# EAGLE design inversor (EAGLE 8.6.3)
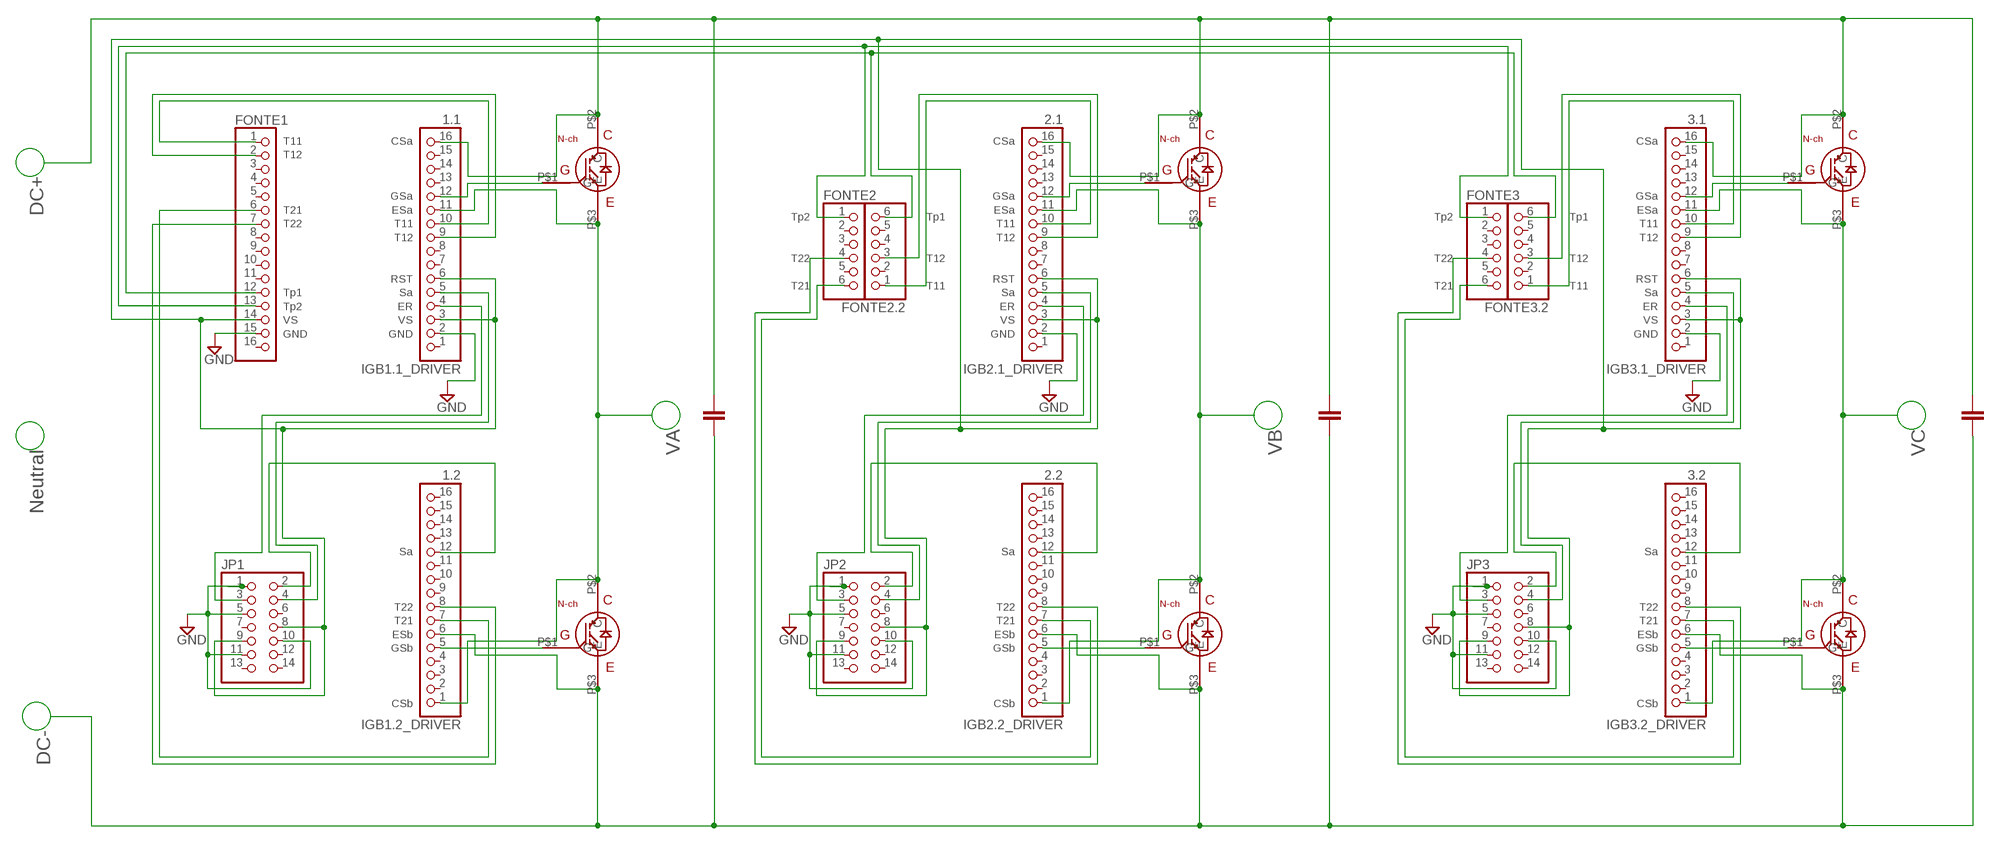
[diagram p0: schematic, sheet 1]

## Parts
FONTE1  PINHD-1X16  [1X16]
FONTE2  PINHD-1X6  [1X06]
FONTE2.2  PINHD-1X6  [1X06]
FONTE3  PINHD-1X6  [1X06]
FONTE3.2  PINHD-1X6  [1X06]
IGB1.1_DRIVER  1.1  PINHD-1X16  [1X16]
IGB1.2_DRIVER  1.2  PINHD-1X16  [1X16]
IGB2.1_DRIVER  2.1  PINHD-1X16  [1X16]
IGB2.2_DRIVER  2.2  PINHD-1X16  [1X16]
IGB3.1_DRIVER  3.1  PINHD-1X16  [1X16]
IGB3.2_DRIVER  3.2  PINHD-1X16  [1X16]
JP1  PINHD-2X7  [2X07]
JP2  PINHD-2X7  [2X07]
JP3  PINHD-2X7  [2X07]
U$1  TO-247A  [TO-247]
U$2  TO-247A  [TO-247]
U$3  TO-247A  [TO-247]
U$4  TO-247A  [TO-247]
U$5  TO-247A  [TO-247]
U$6  TO-247A  [TO-247]

## Nets
DC+: IGB1.1_DRIVER.16 IGB2.1_DRIVER.16 IGB3.1_DRIVER.16 U$1.P$2(C) U$3.P$2(C) U$5.P$2(C)
DC-: IGB1.2_DRIVER.6 IGB2.2_DRIVER.6 IGB3.2_DRIVER.6 U$2.P$3(E) U$4.P$3(E) U$6.P$3(E)
GND: FONTE1.15 IGB1.1_DRIVER.2 IGB2.1_DRIVER.2 IGB3.1_DRIVER.2 JP1.1 JP1.5 JP1.10 JP1.11 JP2.1 JP2.5 JP2.10 JP2.11 JP3.1 JP3.5 JP3.10 JP3.11
N$1: IGB1.1_DRIVER.5 JP1.4
N$3: IGB1.2_DRIVER.12 JP1.2
N$4: IGB1.1_DRIVER.4 JP1.3
N$5: FONTE1.1 IGB1.1_DRIVER.10
N$6: FONTE1.2 IGB1.1_DRIVER.9
N$7: FONTE1.7 IGB1.2_DRIVER.8
N$8: FONTE1.6 IGB1.2_DRIVER.7
N$9: IGB3.1_DRIVER.4 JP3.3
N$13: IGB1.2_DRIVER.5 U$2.P$1(G)
N$15: IGB2.1_DRIVER.5 JP2.4
N$16: IGB2.2_DRIVER.12 JP2.2
N$17: IGB2.1_DRIVER.4 JP2.3
N$18: FONTE2.2.1 IGB2.1_DRIVER.10
N$19: FONTE2.2.3 IGB2.1_DRIVER.9
N$20: FONTE2.4 IGB2.2_DRIVER.8
N$21: FONTE2.6 IGB2.2_DRIVER.7
N$23: IGB2.1_DRIVER.12 U$3.P$1(G)
N$25: IGB2.2_DRIVER.5 U$4.P$1(G)
N$29: IGB3.1_DRIVER.5 JP3.4
N$30: IGB3.2_DRIVER.12 JP3.2
N$32: FONTE3.2.1 IGB3.1_DRIVER.10
N$33: FONTE3.2.3 IGB3.1_DRIVER.9
N$34: FONTE3.4 IGB3.2_DRIVER.8
N$35: FONTE3.6 IGB3.2_DRIVER.7
N$36: IGB3.1_DRIVER.12 U$5.P$1(G)
N$38: IGB3.2_DRIVER.5 U$6.P$1(G)
TP1: FONTE1.12 FONTE2.2.6 FONTE3.2.6
TP2: FONTE1.13 FONTE2.1 FONTE3.1
VA: IGB1.1_DRIVER.11 IGB1.2_DRIVER.1 U$1.P$3(E) U$2.P$2(C)
VB: IGB2.1_DRIVER.11 IGB2.2_DRIVER.1 U$3.P$3(E) U$4.P$2(C)
VC: IGB3.1_DRIVER.11 IGB3.2_DRIVER.1 U$5.P$3(E) U$6.P$2(C)
VS: FONTE1.14 IGB1.1_DRIVER.3 IGB1.1_DRIVER.6 IGB2.1_DRIVER.3 IGB2.1_DRIVER.6 IGB3.1_DRIVER.3 IGB3.1_DRIVER.6 JP1.8 JP1.9 JP2.8 JP2.9 JP3.8 JP3.9
VS1: IGB1.1_DRIVER.12 U$1.P$1(G)
Unconnected: FONTE1.3 FONTE1.4 FONTE1.5 FONTE1.8 FONTE1.9 FONTE1.10 FONTE1.11 FONTE1.16 FONTE2.2 FONTE2.2.2 FONTE2.2.4 FONTE2.2.5 FONTE2.3 FONTE2.5 FONTE3.2 FONTE3.2.2 FONTE3.2.4 FONTE3.2.5 FONTE3.3 FONTE3.5 IGB1.1_DRIVER.1 IGB1.1_DRIVER.7 IGB1.1_DRIVER.8 IGB1.1_DRIVER.13 IGB1.1_DRIVER.14 IGB1.1_DRIVER.15 IGB1.2_DRIVER.2 IGB1.2_DRIVER.3 IGB1.2_DRIVER.4 IGB1.2_DRIVER.9 IGB1.2_DRIVER.10 IGB1.2_DRIVER.11 IGB1.2_DRIVER.13 IGB1.2_DRIVER.14 IGB1.2_DRIVER.15 IGB1.2_DRIVER.16 IGB2.1_DRIVER.1 IGB2.1_DRIVER.7 IGB2.1_DRIVER.8 IGB2.1_DRIVER.13 IGB2.1_DRIVER.14 IGB2.1_DRIVER.15 IGB2.2_DRIVER.2 IGB2.2_DRIVER.3 IGB2.2_DRIVER.4 IGB2.2_DRIVER.9 IGB2.2_DRIVER.10 IGB2.2_DRIVER.11 IGB2.2_DRIVER.13 IGB2.2_DRIVER.14 IGB2.2_DRIVER.15 IGB2.2_DRIVER.16 IGB3.1_DRIVER.1 IGB3.1_DRIVER.7 IGB3.1_DRIVER.8 IGB3.1_DRIVER.13 IGB3.1_DRIVER.14 IGB3.1_DRIVER.15 IGB3.2_DRIVER.2 IGB3.2_DRIVER.3 IGB3.2_DRIVER.4 IGB3.2_DRIVER.9 IGB3.2_DRIVER.10 IGB3.2_DRIVER.11 IGB3.2_DRIVER.13 IGB3.2_DRIVER.14 IGB3.2_DRIVER.15 IGB3.2_DRIVER.16 JP1.6 JP1.7 JP1.12 JP1.13 JP1.14 JP2.6 JP2.7 JP2.12 JP2.13 JP2.14 JP3.6 JP3.7 JP3.12 JP3.13 JP3.14

## Notes on the sheet
- DC+
- T11
  T12
  
  
  
  T21
  T22
  
  
  
  
  Tp1
  Tp2
  VS
  GND
- CSa
  
  
  
  GSa
  ESa
  T11
  T12
  
  
  RST
  Sa
  ER
  VS
  GND
- CSa
  
  
  
  GSa
  ESa
  T11
  T12
  
  
  RST
  Sa
  ER
  VS
  GND
- CSa
  
  
  
  GSa
  ESa
  T11
  T12
  
  
  RST
  Sa
  ER
  VS
  GND
- Tp2
  
  
  T22
  
  T21
- Tp1
  
  
  T12
  
  T11
- Tp2
  
  
  T22
  
  T21
- Tp1
  
  
  T12
  
  T11
- VA | VB | VC
- Neutral
- Sa
  
  
  
  T22
  T21
  ESb
  GSb
  
  
  
  CSb
- Sa
  
  
  
  T22
  T21
  ESb
  GSb
  
  
  
  CSb
- Sa
  
  
  
  T22
  T21
  ESb
  GSb
  
  
  
  CSb
- DC-

## Library data of the parts
FONTE1 IGB1.1_DRIVER IGB1.2_DRIVER IGB2.1_DRIVER IGB2.2_DRIVER IGB3.1_DRIVER IGB3.2_DRIVER = pinhead:PINHD-1X16: PIN HEADER
FONTE2 FONTE2.2 FONTE3 FONTE3.2 = pinhead:PINHD-1X6: PIN HEADER
JP1-JP3 = pinhead:PINHD-2X7: PIN HEADER
U$1-U$6 = to-247_n-channel_igbt:TO-247

## Board
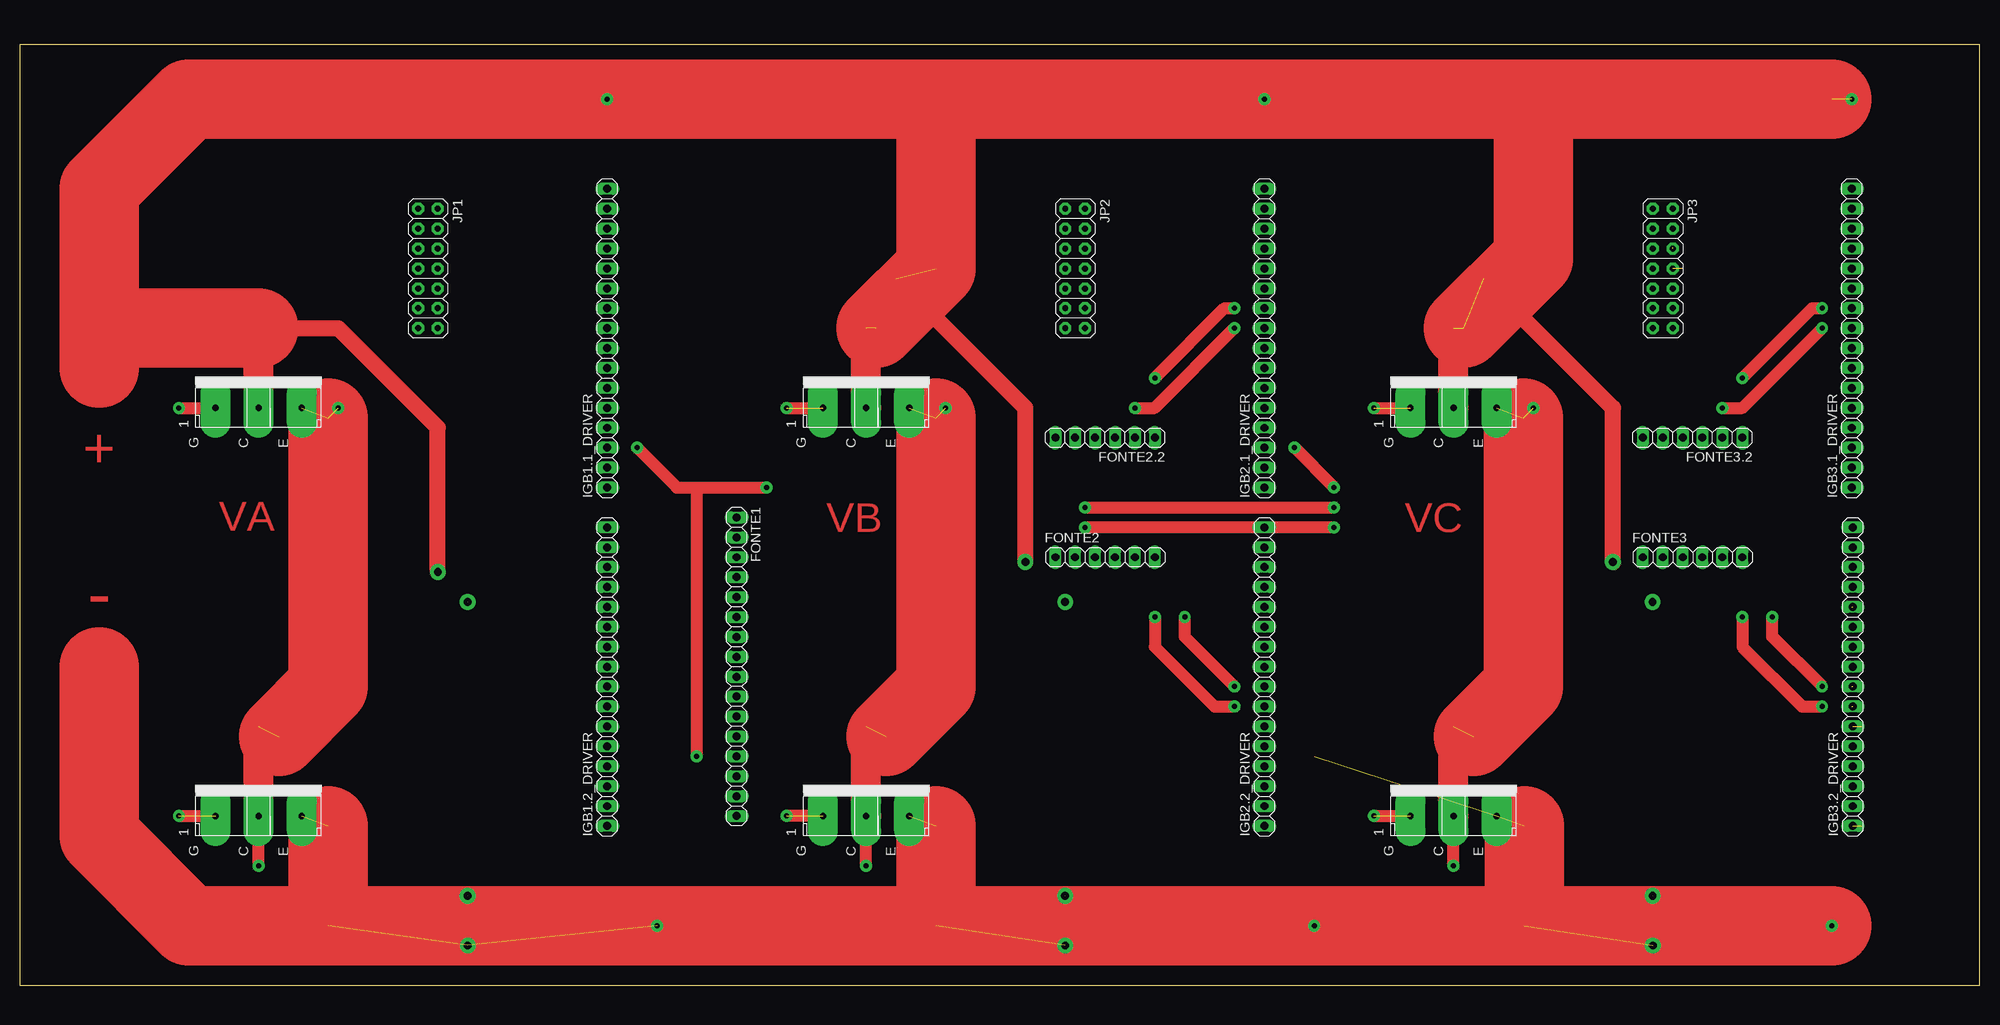
[diagram p1: board, top side]
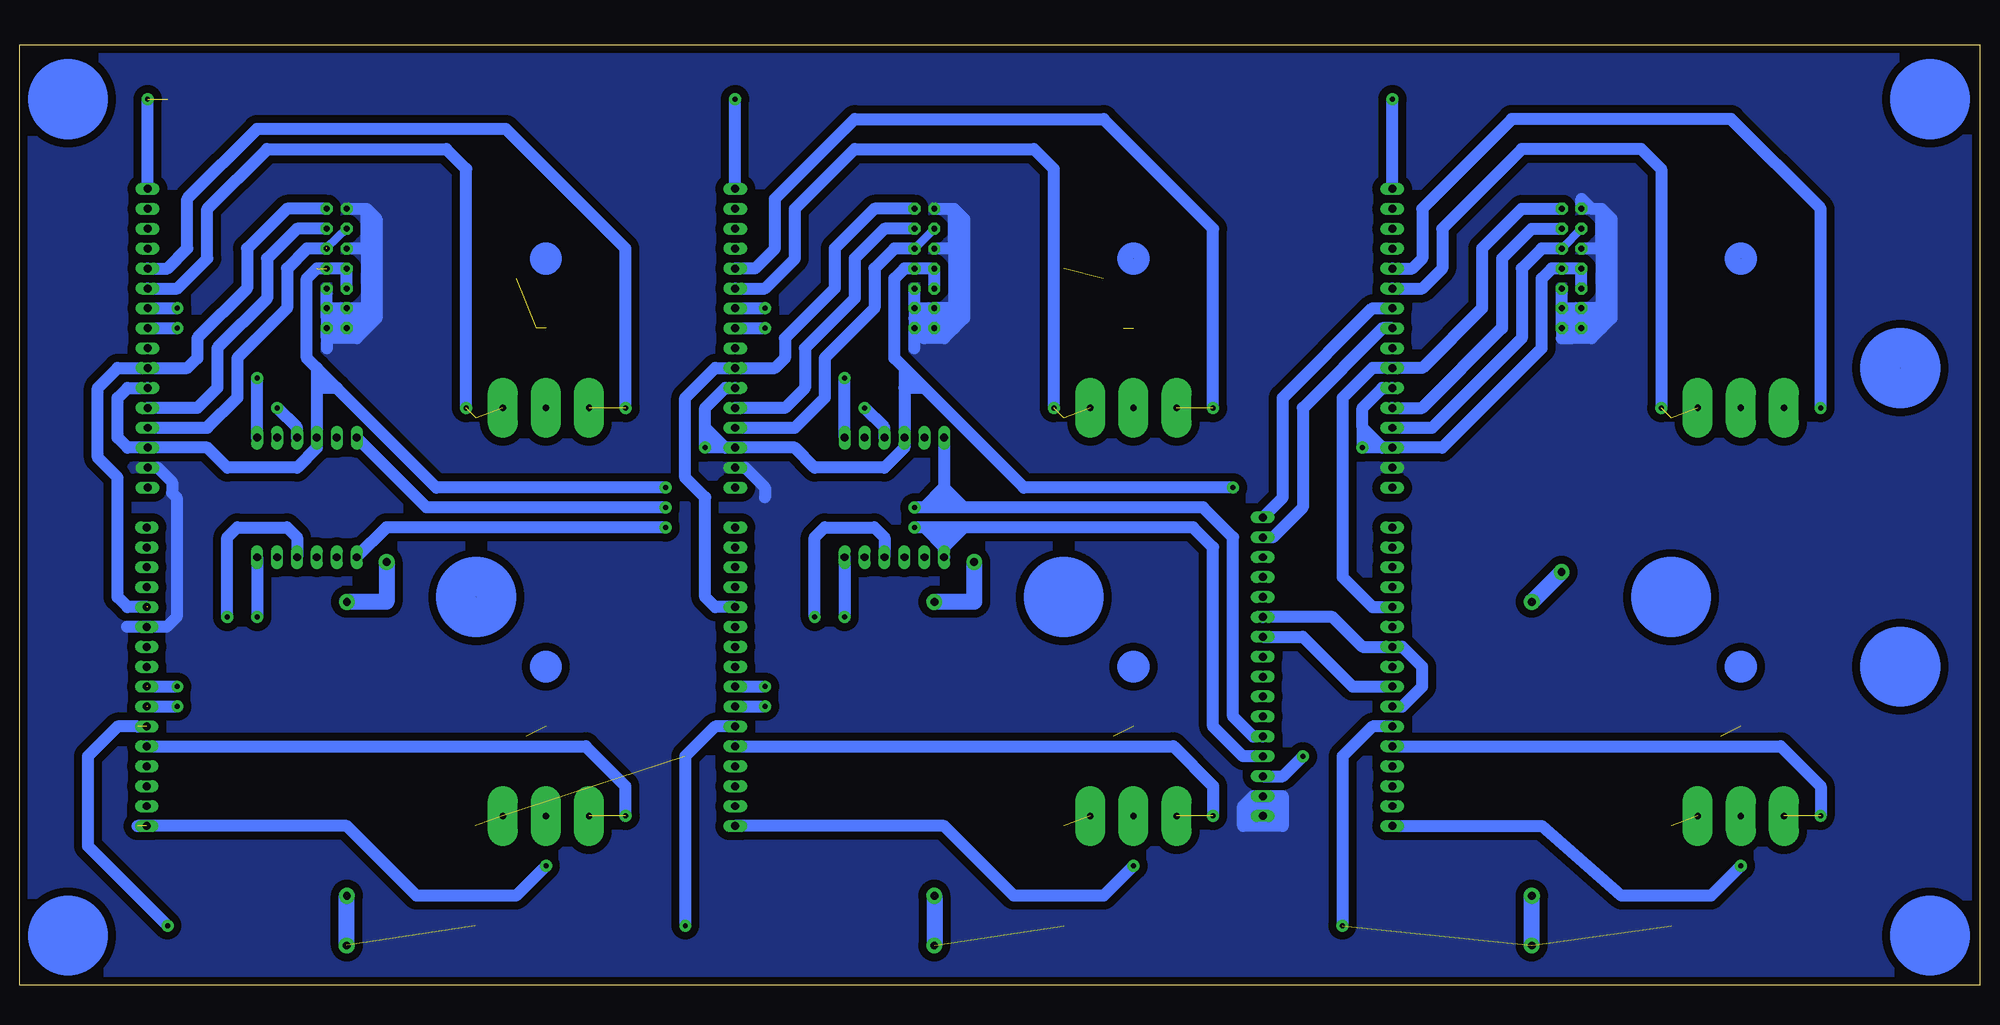
[diagram p2: board, bottom side, seen from below]

Size 250 x 120 mm. Coordinates in mm from the lower left corner, seen from the top.
Outline: 0,0 250,0 250,120 0,120 0,0
Copper layers (1*16): Top 0.035mm / dielectric 1.5mm / Bottom 0.035mm
Design rules "default": minimum track width 6mil, minimum drill 0.35mm, track to track 6mil, track to pad 6mil, pad to pad 6mil, via to via 6mil, smd to smd 6mil, copper to edge 40mil, drill to drill 6mil, minimum pad ring 10mil, minimum via ring 8mil, stop-mask expansion 4mil, vias tented up to drill 0mil, thermal gap 10mil

### Footprints (pad centres in the part's own frame; a part is rotated, then mirrored left to right if it is on the bottom)
1X16 = drill 1.016 long: 1 -19.05,0; 2 -16.51,0; 3 -13.97,0; 4 -11.43,0; 5 -8.89,0; 6 -6.35,0; 7 -3.81,0; 8 -1.27,0; 9 1.27,0; 10 3.81,0; 11 6.35,0; 12 8.89,0; 13 11.43,0; 14 13.97,0; 15 16.51,0; 16 19.05,0
1X06 = drill 1.016 long: 1 -6.35,0; 2 -3.81,0; 3 -1.27,0; 4 1.27,0; 5 3.81,0; 6 6.35,0
2X07 = drill 0.762 pad 1.524 octagon: 1 -7.62,-1.27; 2 -7.62,1.27; 3 -5.08,-1.27; 4 -5.08,1.27; 5 -2.54,-1.27; 6 -2.54,1.27; 7 0,-1.27; 8 0,1.27; 9 2.54,-1.27; 10 2.54,1.27; 11 5.08,-1.27; 12 5.08,1.27; 13 7.62,-1.27; 14 7.62,1.27
TO-247 = drill 0.8 pad 3.81 long: P$1 0,5.5; P$2 0,0; P$3 0,-5.5

### Placement (x,y rotation side)
FONTE1  91.44,40.64 270 top
FONTE2  138.43,54.61 0 top
FONTE2.2  138.43,69.85 180 top
FONTE3  213.36,54.61 0 top
FONTE3.2  213.36,69.85 180 top
IGB1.1_DRIVER  74.93,82.55 90 top
IGB1.2_DRIVER  74.93,39.37 90 top
IGB2.1_DRIVER  158.75,82.55 90 top
IGB2.2_DRIVER  158.75,39.37 90 top
IGB3.1_DRIVER  233.68,82.55 90 top
IGB3.2_DRIVER  233.79,39.37 90 top
JP1  52.07,91.44 270 top
JP2  134.62,91.44 270 top
JP3  209.55,91.44 270 top
U$1  30.48,73.66 90 top
U$2  30.48,21.59 90 top
U$3  107.95,73.66 90 top
U$4  107.95,21.59 90 top
U$5  182.88,73.66 90 top
U$6  182.88,21.59 90 top

### Tracks (layer width: path | path; a pad name or v marks a point on that pad's centre or on a via)
DC+  (via drill 0.6 pad 1.52, 1 pad 2)  (6 unrouted)
  Top 10.16: 193.04,113.03 v158.75,113.03 116.84,113.03 | 116.84,113.03 v74.93,113.03 21.59,113.03 10.16,101.6 10.16,83.82 | 10.16,83.82 10.16,78.74 | 193.04,113.03 231.14,113.03 | 30.48,83.82 10.16,83.82 | 109.22,83.82 116.84,91.44 116.84,113.03 | 184.15,83.82 193.04,92.71 193.04,113.03
  Top 2.032: v53.34,52.72 53.34,71.12 40.64,83.82 30.48,83.82 | v128.27,53.99 128.27,73.66 111.76,90.17 | v203.2,53.99 203.2,73.66 186.69,90.17
  Top 3.81: U$1.P$2 30.48,83.82 | U$3.P$2 107.95,83.82 | U$5.P$2 182.88,83.82
  Bottom 1.524: IGB3.1_DRIVER.16 v233.68,113.03 | IGB2.1_DRIVER.16 v158.75,113.03 | IGB1.1_DRIVER.16 v74.93,113.03
  Bottom 2.032: v57.15,48.91 v53.34,52.72 | v128.27,53.99 128.27,48.91 v133.34,48.91 | v203.2,53.99 203.2,48.91 v208.26,48.91
DC-  (via drill 0.64 pad 1.52, 1 pad 2)  (12 unrouted)
  Top 10.16: 10.16,40.64 10.16,19.05 21.59,7.62 39.37,7.62 | 39.37,7.62 116.84,7.62 | 116.84,7.62 191.88,7.62 | 191.88,20.32 191.88,7.62 | 116.84,20.32 116.84,7.62 | 39.37,7.62 39.37,20.32 | 191.88,7.62 v231.14,7.62
  Bottom 1.524: IGB1.2_DRIVER.6 77.47,33.02 81.28,29.21 v81.28,7.62 | IGB2.2_DRIVER.6 161.29,33.02 165.1,29.21 v165.1,7.62 | 234.95,33.02 237.49,33.02 241.3,29.21 241.3,17.78 v231.14,7.62
  Bottom 2.032: v57.15,5.08 57.15,11.43 | 133.35,11.43 v133.35,5.08 | v208.28,5.08 208.28,11.43
  other vias: 133.34,11.41 57.14,11.41 208.27,11.41
GND
  Bottom 1.524: 236.33,45.72 231.25,45.72 229.98,46.99 229.98,62.23 230.56,62.81 230.56,64.19 232.41,66.04 IGB3.1_DRIVER.2 | 93.98,22.86 92.71,24.13 88.9,24.13 88.9,22.86 | 49.53,99.06 48.26,99.06 | 48.26,99.06 46.99,97.79 46.99,93.98 | 46.99,93.98 48.26,93.98 | 48.26,93.98 JP1.5 | 48.26,93.98 48.26,99.06 | 48.26,93.98 48.26,86.36 | 48.26,86.36 JP1.11 53.34,86.36 | 46.99,93.98 46.99,85.09 48.26,83.82 | 48.26,83.82 53.34,83.82 | 48.26,86.36 48.26,85.09 | 48.26,85.09 48.26,83.82 | 48.26,85.09 53.34,85.09 | JP2.1 130.81,99.06 | 130.81,99.06 129.54,97.79 129.54,93.98 | 129.54,93.98 130.81,93.98 | 130.81,93.98 JP2.5 | 130.81,93.98 130.81,99.06 | 130.81,93.98 130.81,86.36 | 130.81,86.36 JP2.11 135.89,86.36 | 129.54,93.98 129.54,85.09 130.81,83.82 | 130.81,83.82 135.89,83.82 | 130.81,86.36 130.81,85.09 | 130.81,85.09 130.81,83.82 | 135.89,86.36 135.89,85.09 | 135.89,85.09 135.89,83.82 | 135.89,86.36 JP2.10 | 130.81,85.09 135.89,85.09 | JP3.1 205.74,99.06 | 205.74,99.06 204.47,97.79 204.47,93.98 | 204.47,93.98 205.74,93.98 | 205.74,93.98 JP3.5 | 205.74,93.98 205.74,99.06 | 205.74,93.98 205.74,86.36 | 204.47,93.98 204.47,85.09 205.74,83.82 | 205.74,83.82 210.82,83.82 | 205.74,86.36 205.74,85.09 | 205.74,85.09 205.74,83.82 | 210.82,86.36 205.74,86.36 | 210.82,85.09 210.82,83.82 | 210.82,85.09 210.82,86.36 | 210.82,86.36 JP3.10 | 205.74,85.09 210.82,85.09 | 48.26,83.82 49.53,82.55 52.07,82.55 | 52.07,82.55 53.34,83.82 | 130.81,83.82 132.08,82.55 134.62,82.55 135.89,83.82 | 205.74,83.82 207.01,82.55 210.82,82.55 | 210.82,82.55 210.82,83.82 | 88.9,22.86 88.9,21.59 | 88.9,21.59 93.98,21.59 | 93.98,21.59 93.98,22.86 | 93.98,22.86 88.9,22.86 | 53.34,86.36 JP1.10 | 49.53,99.06 50.8,100.33 JP1.1 49.53,99.06
  Bottom 1.524: 53.34,83.82 53.34,82.55 52.07,82.55 | 53.34,83.82 53.34,85.09 | 53.34,85.09 53.34,86.36 | 88.9,21.59 88.9,20.32 93.98,20.32 93.98,21.59 | 135.89,81.28 135.89,83.82 | 210.82,82.55 210.82,81.28 | IGB2.1_DRIVER.2 157.48,66.04 154.94,63.5 154.94,62.23
  pour Bottom (isolate 1.016): 0,120 0,0 250,0 250,120
N$1
  Bottom 1.524: IGB1.1_DRIVER.5 71.12,73.66 60.96,83.82 60.96,92.71 57.15,96.52 JP1.4
N$3
  Bottom 1.524: JP1.2 58.42,99.06 63.5,93.98 63.5,86.36 71.12,78.74 77.47,78.74 81.28,74.93 81.28,52.07 77.47,48.26 IGB1.2_DRIVER.12
N$4
  Bottom 1.016: JP1.3 53.34,93.98
  Bottom 1.524: IGB1.1_DRIVER.4 69.85,71.12 58.42,82.55 58.42,91.44 55.88,93.98 53.34,93.98
N$5
  Bottom 1.524: FONTE1.1 88.9,62.23 88.9,74.93 77.47,86.36 IGB1.1_DRIVER.10
N$6
  Bottom 1.524: IGB1.1_DRIVER.9 76.2,83.82 86.36,73.66 86.36,60.96 90.17,57.15 FONTE1.2
N$7
  Bottom 1.524: FONTE1.7 86.36,44.45 80.01,38.1 IGB1.2_DRIVER.8
N$8
  Bottom 1.524: IGB1.2_DRIVER.7 73.66,35.56 71.12,38.1 71.12,40.64 73.66,43.18 78.74,43.18 82.55,46.99 FONTE1.6
N$9  (1 unrouted)
  Bottom 1.016: JP3.3 210.82,94.09
  Bottom 1.524: IGB3.1_DRIVER.4 226.06,71.12 222.25,74.93 222.25,80.01 215.9,86.36 215.9,91.44 213.36,93.98 210.82,93.98
N$13  (1 unrouted)
  Bottom 1.524: IGB1.2_DRIVER.5 25.4,30.48 20.32,25.4 20.32,21.59
N$15
  Bottom 1.524: JP2.4 139.7,96.52 143.51,92.71 143.51,87.63 149.86,81.28 149.86,76.2 152.4,73.66 IGB2.1_DRIVER.5
N$16
  Bottom 1.524: IGB2.2_DRIVER.12 161.29,48.26 162.56,49.53 162.56,62.23 165.1,64.77 165.1,74.93 161.29,78.74 153.67,78.74 152.4,80.01 152.4,82.55 146.05,88.9 146.05,93.98 140.97,99.06 JP2.2
N$17
  Bottom 1.016: JP2.3 135.89,93.98
  Bottom 1.524: IGB2.1_DRIVER.4 151.13,71.12 147.32,74.93 147.32,80.01 140.97,86.36 140.97,91.44 138.43,93.98 135.89,93.98
N$18  (via drill 0.64 pad 1.52)
  Top 1.524: v144.78,77.47 153.67,86.36 v154.94,86.36
  Bottom 1.524: IGB2.1_DRIVER.10 v154.94,86.36 | FONTE2.2.1 v144.78,77.47
N$19  (via drill 0.64 pad 1.52)
  Top 1.524: v142.24,73.66 144.78,73.66 v154.94,83.82
  Bottom 1.524: IGB2.1_DRIVER.9 v154.94,83.82 | FONTE2.2.3 139.7,71.12 v142.24,73.66
N$20  (via drill 0.64 pad 1.52)
  Top 1.524: v154.94,38.1 148.59,44.45 v148.59,46.99
  Bottom 1.524: IGB2.2_DRIVER.8 v154.94,38.1 | FONTE2.4 139.7,57.15 140.97,58.42 147.32,58.42 148.59,57.15 v148.59,46.99
N$21  (via drill 0.64 pad 1.52)
  Top 1.524: v144.78,46.99 144.78,43.18 152.4,35.56 v154.94,35.56
  Bottom 1.524: FONTE2.6 v144.78,46.99 | IGB2.2_DRIVER.7 v154.94,35.56
N$23  (1 unrouted)
  Bottom 1.524: 97.79,73.66 97.79,96.52 111.76,110.49 143.51,110.49 153.67,100.33 153.67,93.98 156.21,91.44 IGB2.1_DRIVER.12
N$25  (1 unrouted)
  Bottom 1.524: IGB2.2_DRIVER.5 102.87,30.48 97.79,25.4 97.79,21.59
N$29
  Bottom 1.524: JP3.4 214.63,96.52 218.44,92.71 218.44,87.63 224.79,81.28 224.79,76.2 227.33,73.66 IGB3.1_DRIVER.5
N$30  (1 unrouted)
  Bottom 1.524: JP3.2 215.9,99.06 220.98,93.98 220.98,88.9 227.33,82.55 227.33,80.01 228.6,78.74 237.49,78.74 240.03,76.2 240.03,67.31 237.49,64.77 237.49,49.53 236.22,48.26 233.68,48.26
N$32  (via drill 0.64 pad 1.52)
  Top 1.524: v219.71,77.47 228.6,86.36 v229.87,86.36
  Bottom 1.524: IGB3.1_DRIVER.10 v229.87,86.36 | FONTE3.2.1 v219.71,77.47
N$33  (via drill 0.64 pad 1.52)
  Top 1.524: v217.17,73.66 219.71,73.66 v229.87,83.82
  Bottom 1.524: IGB3.1_DRIVER.9 v229.87,83.82 | FONTE3.2.3 214.63,71.12 v217.17,73.66
N$34  (via drill 0.64 pad 1.52)  (1 unrouted)
  Top 1.524: v229.87,38.1 223.52,44.45 v223.52,46.99
  Bottom 1.524: IGB3.2_DRIVER.8 229.98,38.1 | 233.68,38.1 v229.87,38.1 | v223.52,46.99 223.52,57.15 222.25,58.42 215.9,58.42 214.63,57.15 FONTE3.4
N$35  (via drill 0.64 pad 1.52)  (1 unrouted)
  Top 1.524: v219.71,46.99 219.71,43.18 227.33,35.56 v229.87,35.56
  Bottom 1.524: FONTE3.6 v219.71,46.99 | 233.68,35.56 v229.87,35.56
N$36  (1 unrouted)
  Bottom 1.524: 172.72,73.66 172.72,93.98 187.96,109.22 219.71,109.22 228.6,100.33 228.6,93.98 231.14,91.44 IGB3.1_DRIVER.12
N$38  (1 unrouted)
  Bottom 1.524: IGB3.2_DRIVER.5 177.8,30.48 172.72,25.4 172.72,21.59
TP1  (via drill 0.64 pad 1.52)
  Top 1.524: v135.89,60.96 v167.64,60.96
  Bottom 1.524: 129.54,60.96 99.06,60.96 95.25,57.15 95.25,34.29 92.71,31.75 FONTE1.12 | 129.54,60.96 132.08,60.96 | v167.64,60.96 198.12,60.96 FONTE3.2.6 | 132.08,60.96 134.62,60.96 | 134.62,60.96 v135.89,60.96 | FONTE2.2.6 132.08,63.5 | 132.08,63.5 132.08,60.96 | 129.54,60.96 132.08,63.5 | 134.62,60.96 132.08,63.5
TP2  (via drill 0.64 pad 1.52)
  Top 1.524: v167.64,58.42 v135.89,58.42
  Bottom 1.524: FONTE1.13 93.98,29.21 97.79,33.02 97.79,55.88 100.33,58.42 129.54,58.42 | 129.54,58.42 132.08,58.42 | 132.08,58.42 134.62,58.42 | 134.62,58.42 v135.89,58.42 | v167.64,58.42 203.2,58.42 FONTE3.1 | FONTE2.1 132.08,55.88 | 132.08,55.88 132.08,58.42 | 129.54,58.42 132.08,55.88 | 134.62,58.42 132.08,55.88
VA  (via drill 0.64 pad 1.52)  (3 unrouted)
  Top 1.524: v30.48,15.24 U$2.P$2
  Top 10.16: 39.37,72.39 39.37,38.1 33.02,31.75
  Top 3.81: U$2.P$2 30.48,33.02
  Bottom 1.524: IGB1.1_DRIVER.11 71.12,88.9 68.58,91.44 68.58,96.52 58.42,106.68 43.18,106.68 40.64,104.14 v40.64,73.66 | IGB1.2_DRIVER.1 55.88,20.32 45.72,11.43 34.29,11.43 v30.48,15.24
VB  (via drill 0.64 pad 1.52)  (3 unrouted)
  Top 1.524: v107.95,15.24 U$4.P$2
  Top 10.16: 116.84,72.39 116.84,38.1 110.49,31.75
  Top 3.81: U$4.P$2 107.95,33.02
  Bottom 1.524: IGB2.1_DRIVER.11 154.94,88.9 151.13,92.71 151.13,99.06 143.51,106.68 120.65,106.68 118.11,104.14 118.11,73.66 | v107.95,15.24 111.76,11.43 123.19,11.43 132.08,20.32 IGB2.2_DRIVER.1
VC  (via drill 0.64 pad 1.52)  (4 unrouted)
  Top 1.524: v182.88,15.24 U$6.P$2
  Top 10.16: 191.77,72.39 191.77,38.1 185.42,31.75
  Top 3.81: U$6.P$2 182.88,33.02
  Bottom 1.524: v182.88,15.24 186.69,11.43 199.39,11.43 208.28,20.32 234.95,20.32 | 193.04,73.66 193.04,104.14 195.58,106.68 218.44,106.68 226.06,99.06 226.06,92.71 229.87,88.9 IGB3.1_DRIVER.11
VS  (via drill 0.64 pad 1.52)  (1 unrouted)
  Top 1.524: 86.36,63.5 v86.36,29.21 | 86.36,63.5 v95.25,63.5 | v78.74,68.58 83.82,63.5 86.36,63.5 | v162.56,68.58 v167.64,63.5
  Bottom 1.524: 76.2,68.58 IGB1.1_DRIVER.3 68.58,68.58 55.88,81.28 55.88,90.17 54.61,91.44 JP1.8 50.8,91.44 JP1.9 | IGB1.1_DRIVER.6 76.2,76.2 78.74,73.66 78.74,71.12 | 160.02,68.58 IGB2.1_DRIVER.3 151.13,68.58 148.59,66.04 139.7,66.04 137.16,68.58 137.16,76.2 | 160.02,68.58 v162.56,68.58 162.56,71.12 | 162.56,71.12 162.56,73.66 160.02,76.2 IGB2.1_DRIVER.6 | JP2.9 133.35,91.44 JP2.8 137.16,91.44 138.43,90.17 138.43,80.01 137.16,78.74 | FONTE1.14 88.9,26.67 v86.36,29.21 | v95.25,63.5 121.92,63.5 134.62,76.2 | 134.62,76.2 137.16,78.74 | 137.16,78.74 137.16,76.2 | v167.64,63.5 196.85,63.5 209.55,76.2 | 209.55,76.2 212.09,78.74 | 212.09,78.74 213.36,80.01 213.36,90.17 212.09,91.44 208.28,91.44 JP3.9 | 212.09,78.74 212.09,76.2 | 212.09,76.2 212.09,68.58 214.63,66.04 223.52,66.04 226.06,68.58 IGB3.1_DRIVER.3 236.22,68.58 237.49,69.85 237.49,74.93 236.22,76.2 IGB3.1_DRIVER.6 | 209.55,76.2 212.09,76.2 | 134.62,76.2 137.16,76.2 | 76.2,68.58 78.74,71.12 | 78.74,71.12 v78.74,68.58 76.2,68.58 | 160.02,68.58 162.56,71.12
VS1  (via drill 0.64 pad 1.52)
  Top 1.524: v20.32,73.66 U$1.P$1
  Bottom 1.524: IGB1.1_DRIVER.12 72.39,91.44 71.12,92.71 71.12,99.06 59.69,110.49 31.75,110.49 20.32,99.06 v20.32,73.66
VS3  (via drill 0.64 pad 1.52)
  Top 1.524: v97.79,73.66 102.87,73.66
VS4  (via drill 0.64 pad 1.52)
  other vias: 118.11,73.66
VS5  (via drill 0.64 pad 1.52)
  Top 1.524: v172.72,73.66 177.8,73.66
VS6  (via drill 0.64 pad 1.52)
  other vias: 193.04,73.66
VS7  (via drill 0.64 pad 1.52)
  Top 1.524: v172.72,21.59 177.8,21.59
VS9  (via drill 0.64 pad 1.52)
  Top 1.524: 102.87,21.59 v97.79,21.59
VS11  (via drill 0.64 pad 1.52)
  Top 1.524: v20.32,21.59 25.4,21.59
(copper drawn outside any net)
  shapes: Bottom circle x16

### Text on the board
Top: + | VA | VB | VC | -